# Altium project CC2541Dev_board.PrjPcb
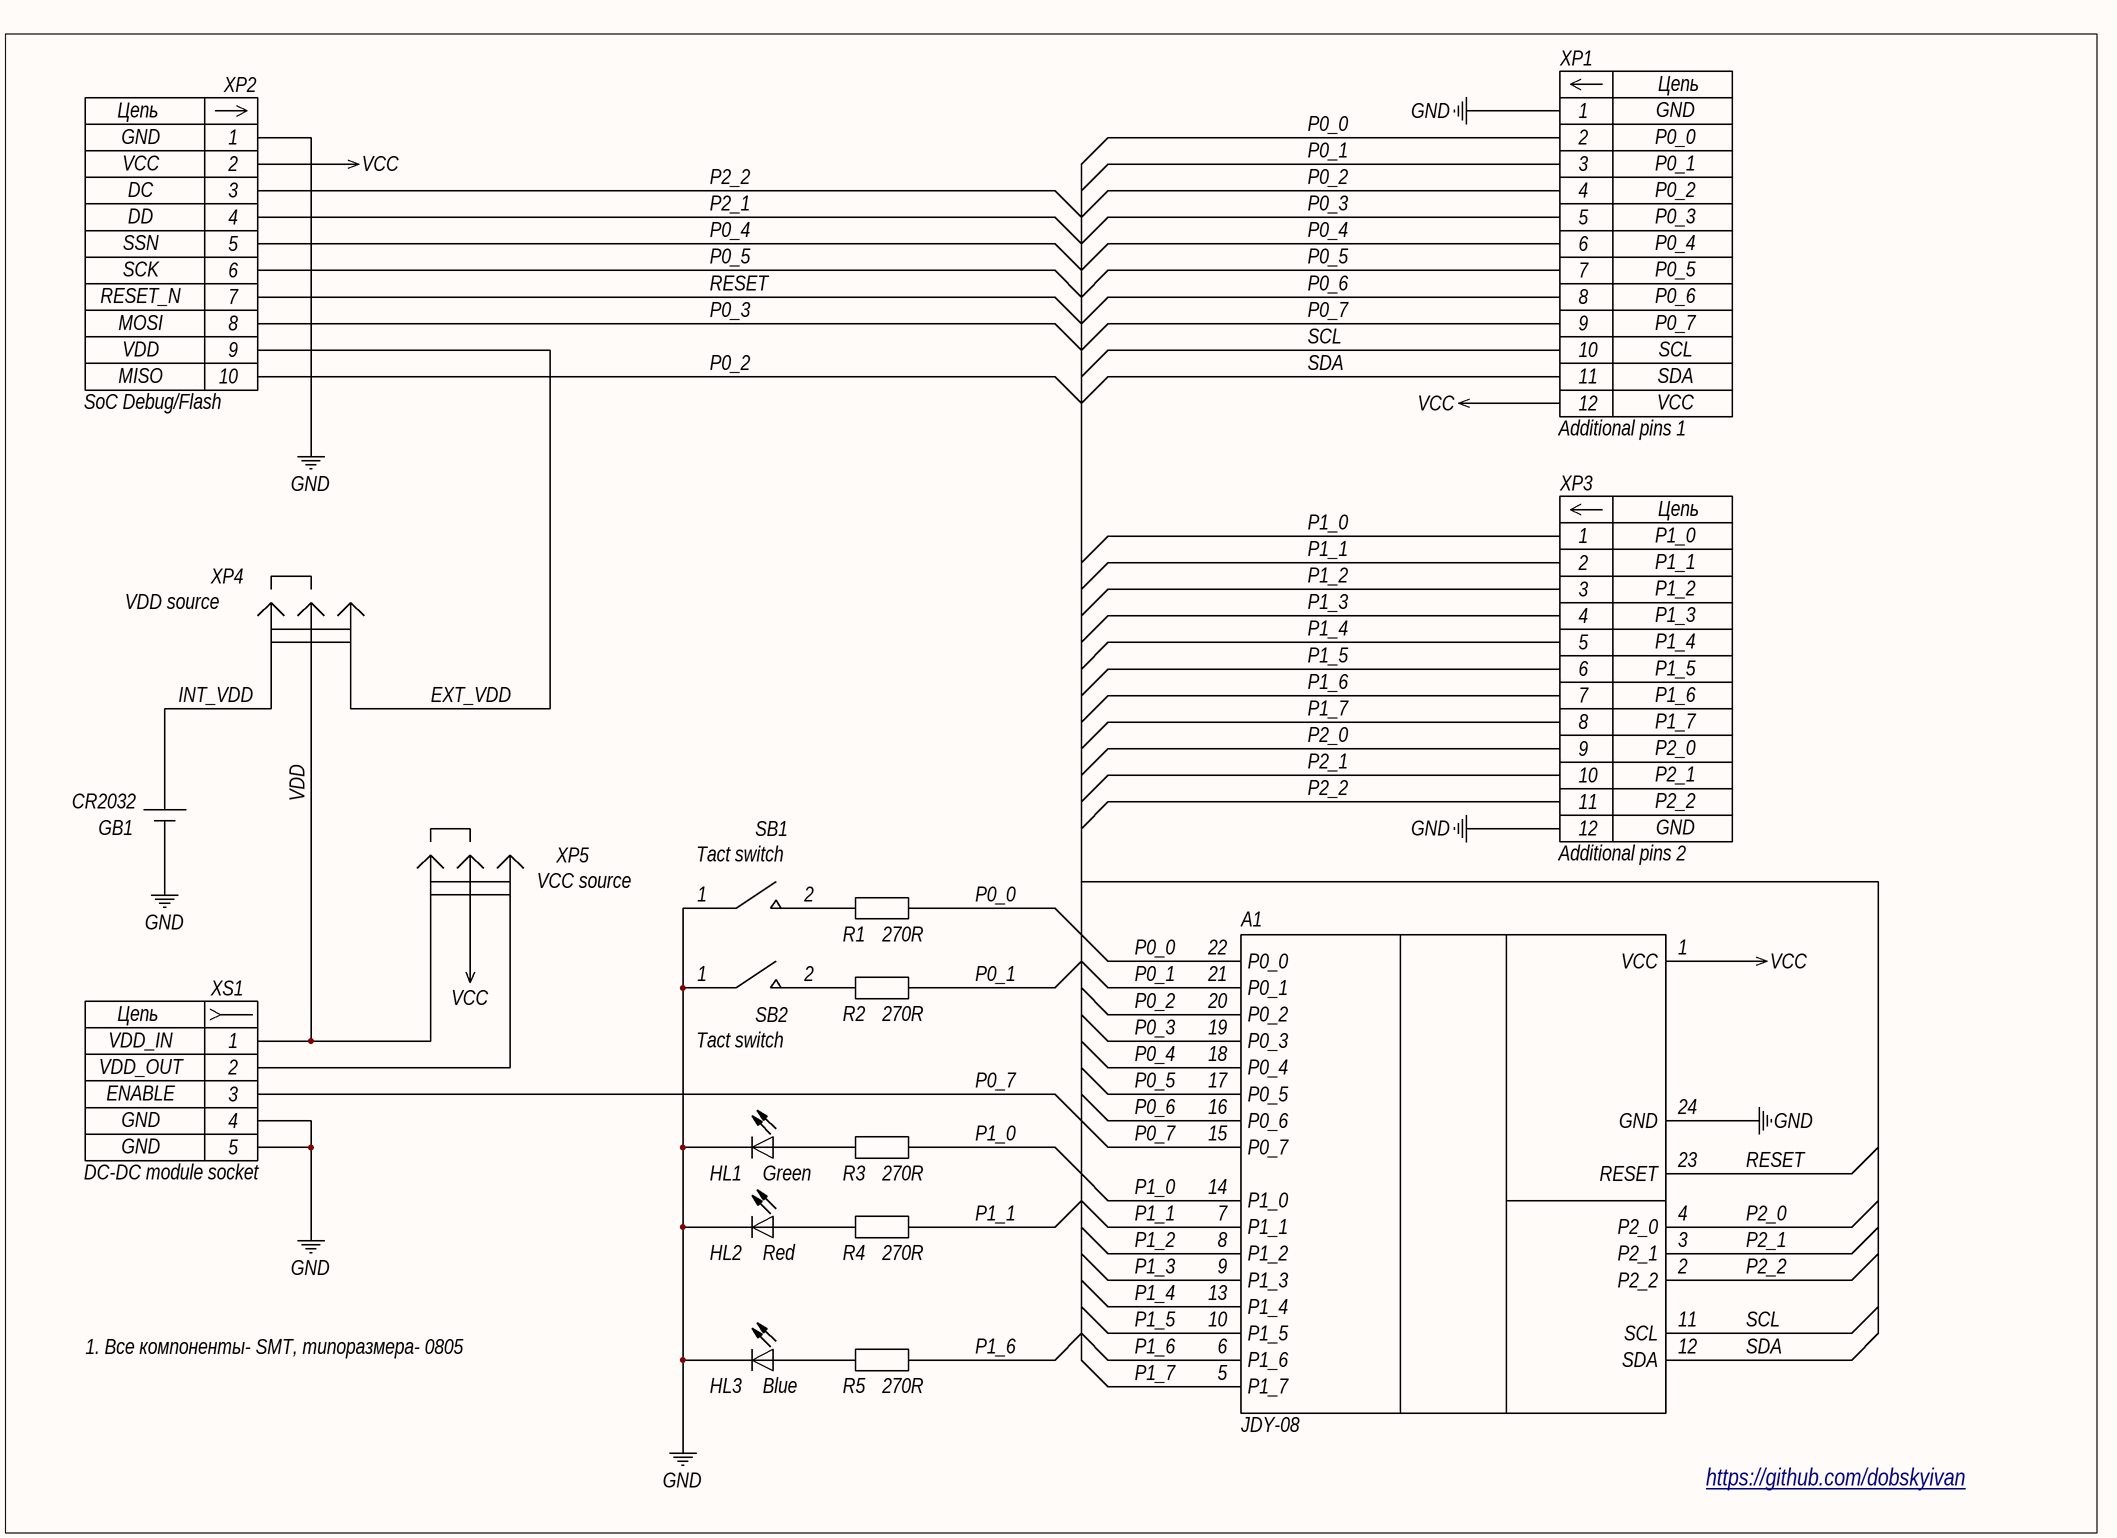
[diagram p0: CC2541Dev_board.SchDoc]
1 sheet, 18 parts. Net scope: global (net labels, ports and power ports of the same name join across sheets).
Board file: CC2541Dev_board.PcbDoc

## Sheet CC2541Dev_board.SchDoc
size A3

### Parts
A1  JDY-08  [JDY-08]
GB1  CR2032  [S8421R]
HL1  Green  [LED_0805_GREEN]
HL2  Red  [LED_0805_GREEN]
HL3  Blue  [LED_0805_GREEN]
R1  270R  [RES_0805]
R2  270R  [RES_0805]
R3  270R  [RES_0805]
R4  270R  [RES_0805]
R5  270R  [RES_0805]
SB1  Tact switch  [KLS7-TS6601-5.0-180]
SB2  Tact switch  [KLS7-TS6601-5.0-180]
XP1  Additional pins 1  [PLS12]
XP2  SoC Debug/Flash  [PLD10]
XP3  Additional pins 2  [PLS12]
XP4  VDD source  [PLS3]
XP5  VCC source  [PLS3]
XS1  DC-DC module socket  [PAD]

### Nets
GND: A1.24(GND) GB1.2 HL1.2 HL2.2 HL3.2 SB1.1(MR) SB2.1(MR) XP1.1 XP2.1 XP3.12 XS1.4 XS1.5
VCC: A1.1(VCC) XP1.12 XP2.2 XP5.2
EXT_VDD: XP2.9 XP4.3
INT_VDD: GB1.1 XP4.1
P0_0: A1.22(P0_0) R1.2 XP1.2
P0_1: A1.21(P0_1) R2.2 XP1.3
P0_2: A1.20(P0_2) XP1.4 XP2.10
P0_3: A1.19(P0_3) XP1.5 XP2.8
P0_4: A1.18(P0_4) XP1.6 XP2.5
P0_5: A1.17(P0_5) XP1.7 XP2.6
P0_6: A1.16(P0_6) XP1.8
P0_7: A1.15(P0_7) XP1.9 XS1.3
P1_0: A1.14(P1_0) R3.2 XP3.1
P1_1: A1.7(P1_1) R4.2 XP3.2
P1_2: A1.8(P1_2) XP3.3
P1_3: A1.9(P1_3) XP3.4
P1_4: A1.13(P1_4) XP3.5
P1_5: A1.10(P1_5) XP3.6
P1_6: A1.6(P1_6) R5.2 XP3.7
P1_7: A1.5(P1_7) XP3.8
P2_0: A1.4(P2_0) XP3.9
P2_1: A1.3(P2_1) XP2.4 XP3.10
P2_2: A1.2(P2_2) XP2.3 XP3.11
RESET: A1.23(RESET) XP2.7
SCL: A1.11(SCL) XP1.10
SDA: A1.12(SDA) XP1.11
VDD: XP4.2 XP5.1 XS1.1
NetHL1_1: HL1.1 R3.1
NetHL2_1: HL2.1 R4.1
NetHL3_1: HL3.1 R5.1
NetR1_1: R1.1 SB1.2(MR)
NetR2_1: R2.1 SB2.2(MR)
NetXP5_3: XP5.3 XS1.2

### Notes on the sheet
- 1. Все компоненты- SMT, типоразмера- 0805
- https://github.com/dobskyivan
- (in symbol PIN-10) Цепь
- (in symbol PIN-12) Цепь
- (in symbol SOCKET-5) Цепь

### Library data of the parts
A1 = JDY-08: Модуль BLE, на базе МК CC2541; Class: Устройство; Note: *; Vendor: *
GB1 = BAT: Батарея; Class: Генераторы, источники питания; Vendor: *; Note: *
HL1-HL3 = DIODE_LED: Светодиод, прибор световой сигнализации; Class: Устройства индикационные и сигнальные; Note: Color; Vendor: *
R1-R5 = RESISTOR: Постоянный резистор / ("Mode" переключает внешний вид) / \ 0.25 Вт; \\ 0.125 Вт; \\\ 0.05 Вт; -- 0.5 Вт; | 1 Вт: || 2 Вт; V 5 Вт; Class: Резисторы; Vendor: *; Note: *
SB1 SB2 = SWITCH: Выключатель кнопочный (кнопка) / ("Mode" переключает внешний вид) / 1. Замыкающая без фиксации / 2. Замыкающая c фиксацией / 3. Размыкающая без фиксации / 4. Размыкающая с фиксации; Class: Устройства коммутационные в цепях управления, сигнализации и измерительных
XP1 = PIN-12: Штырь, 12 контактов /; Contact_1: GND; Contact_2: P0_0; Contact_3: P0_1; Class: Соединения контактные; Contact_4: P0_2; Contact_5: P0_3; Contact_6: P0_4; Contact_7: P0_5; Contact_8: P0_6; Contact_9: P0_7; Contact_10: SCL; Contact_11: SDA; Contact_12: VCC
XP2 = PIN-10: Штырь, 10 контактов /; Contact_1: GND; Contact_2: VCC; Contact_3: DC; Class: Соединения контактные; Contact_4: DD; Contact_5: SSN; Contact_6: SCK; Contact_7: RESET_N; Contact_8: MOSI; Contact_9: VDD; Contact_10: MISO
XP3 = PIN-12: Штырь, 12 контактов /; Contact_1: P1_0; Contact_2: P1_1; Contact_3: P1_2; Class: Соединения контактные; Contact_4: P1_3; Contact_5: P1_4; Contact_6: P1_5; Contact_7: P1_6; Contact_8: P1_7; Contact_9: P2_0; Contact_10: P2_1; Contact_11: P2_2; Contact_12: GND
XP4 XP5 = PIN-3: Штырь, 3 контакта / ("Mode" переключает внешний вид); Class: Соединения контактные
XS1 = SOCKET-5: Гнездо, 5 контактов; Contact_1: VDD_IN; Contact_2: VDD_OUT; Contact_3: ENABLE; Contact_4: GND; Class: Соединения контактные; Contact_5: GND